# Altium schematic sheet TOP.SchDoc
size A4
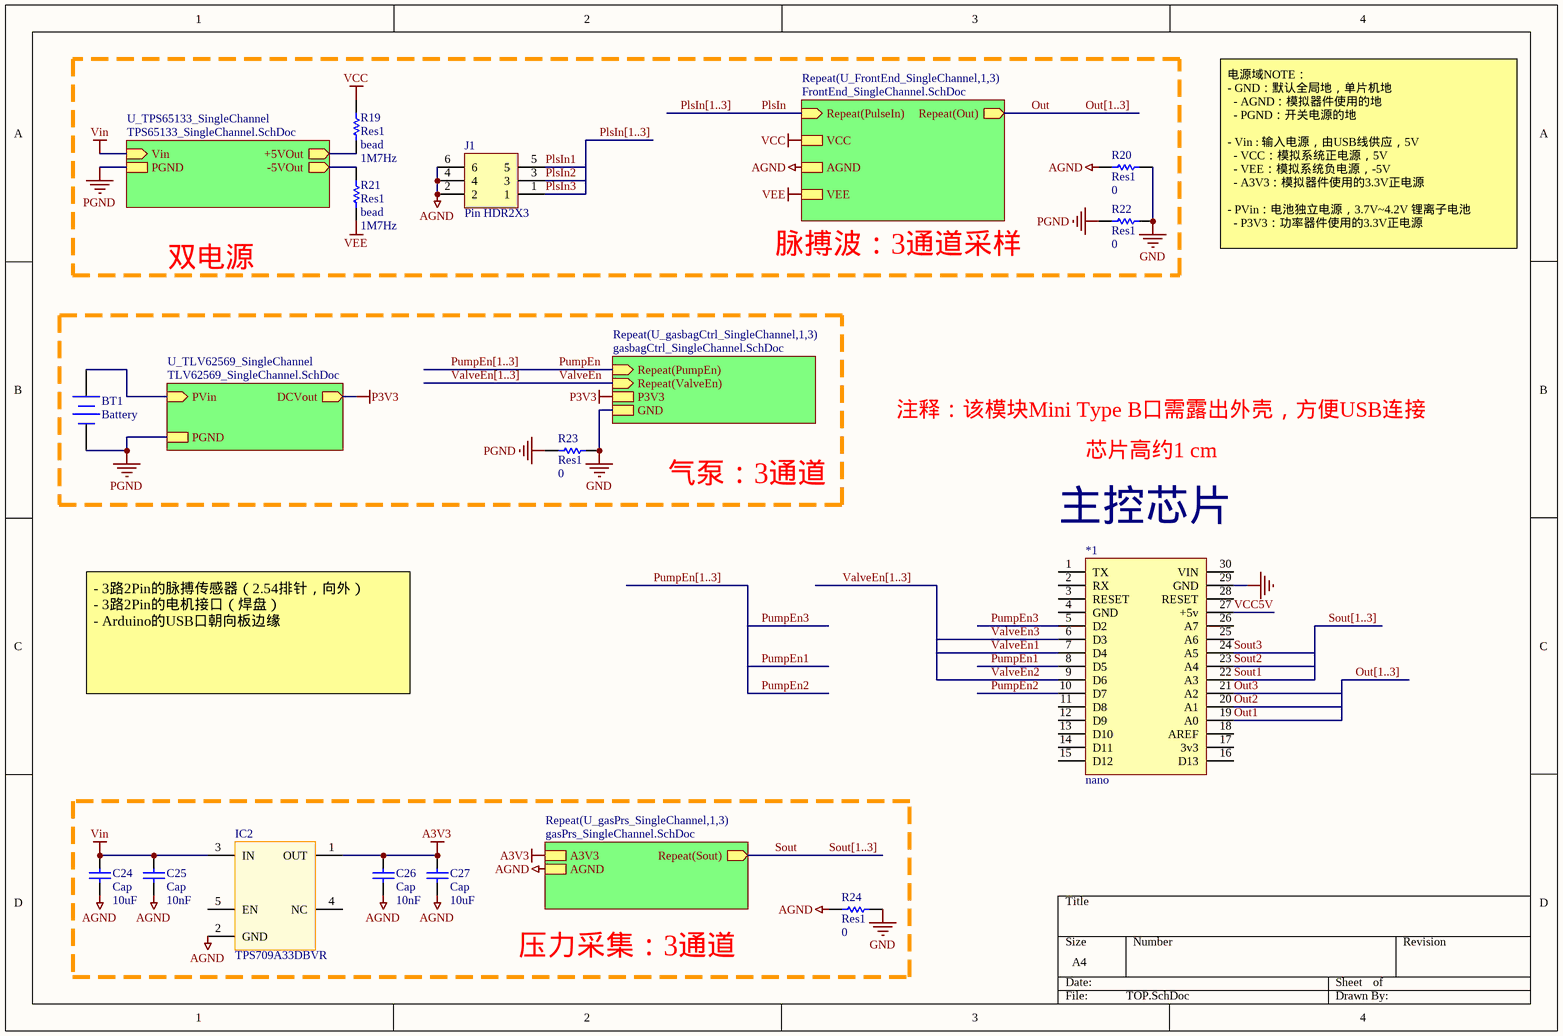
[diagram p0: TOP.SchDoc]

## Parts
*1  nano  [nano]
BT1  Battery  [BAT-2]
C24  Cap  value 10uF  [0603C]
C25  Cap  value 10nF  [0603C]
C26  Cap  value 10nF  [0603C]
C27  Cap  value 10uF  [0603C]
IC2  TPS709A33DBVR  [SOT95P280X145-5N]
J1  Pin HDR2X3  [Pin HDR2X3/2.54mm-S]
R19  Res1  value bead  Frequency: 1M7Hz  [0603R]
R20  Res1  value 0  [0603R]
R21  Res1  value bead  Frequency: 1M7Hz  [0603R]
R22  Res1  value 0  [0603R]
R23  Res1  value 0  [0603R]
R24  Res1  value 0  [0603R]

## Blocks framed on the sheet
气泵：3通道: BT1 R23
压力采集：3通道: C24-C27 IC2 R24

## Sub-sheets
Repeat(U_FrontEnd_SingleChannel,1,3) = FrontEnd_SingleChannel.SchDoc: Repeat(PulseIn) (in), AGND, Repeat(Out) (out), VCC, VEE
Repeat(U_gasbagCtrl_SingleChannel,1,3) = gasbagCtrl_SingleChannel.SchDoc: Repeat(PumpEn) (in), Repeat(ValveEn) (in), P3V3, GND
Repeat(U_gasPrs_SingleChannel,1,3) = gasPrs_SingleChannel.SchDoc: Repeat(Sout) (out), A3V3, AGND
U_TLV62569_SingleChannel = TLV62569_SingleChannel.SchDoc: PVin (in), DCVout (out), PGND
U_TPS65133_SingleChannel = TPS65133_SingleChannel.SchDoc: Vin (in), +5VOut (out), -5VOut (out), PGND

## Nets
A3V3: C26.2 C27.2 IC2.1(OUT) ; sheet Repeat(U_gasPrs_SingleChannel,1,3)/A3V3
AGND: C24.1 C25.1 C26.1 C27.1 IC2.2(GND) J1.2 J1.4 J1.6 R20.1 R24.1 ; sheet Repeat(U_FrontEnd_SingleChannel,1,3)/AGND, sheet Repeat(U_gasPrs_SingleChannel,1,3)/AGND
GND: *1.29(GND) R20.2 R22.2 R23.2 R24.2 ; sheet Repeat(U_gasbagCtrl_SingleChannel,1,3)/GND
P3V3: sheet Repeat(U_gasbagCtrl_SingleChannel,1,3)/P3V3, sheet U_TLV62569_SingleChannel/DCVout
PGND: BT1.2(-) R22.1 R23.1 ; sheet U_TPS65133_SingleChannel/PGND, sheet U_TLV62569_SingleChannel/PGND
VCC: R19.2 ; sheet Repeat(U_FrontEnd_SingleChannel,1,3)/VCC
VEE: R21.1 ; sheet Repeat(U_FrontEnd_SingleChannel,1,3)/VEE
Vin: C24.2 C25.2 IC2.3(IN) ; sheet U_TPS65133_SingleChannel/Vin
Out: sheet Repeat(U_FrontEnd_SingleChannel,1,3)/Repeat(Out)
Out1: *1.19(A0)
Out2: *1.20(A1)
Out3: *1.21(A2)
PlsIn: sheet Repeat(U_FrontEnd_SingleChannel,1,3)/Repeat(PulseIn)
PlsIn1: J1.5
PlsIn2: J1.3
PlsIn3: J1.1
PumpEn: sheet Repeat(U_gasbagCtrl_SingleChannel,1,3)/Repeat(PumpEn)
PumpEn1: *1.8(D5)
PumpEn2: *1.10(D7)
PumpEn3: *1.5(D2)
Sout: sheet Repeat(U_gasPrs_SingleChannel,1,3)/Repeat(Sout)
Sout1: *1.22(A3)
Sout2: *1.23(A4)
Sout3: *1.24(A5)
ValveEn: sheet Repeat(U_gasbagCtrl_SingleChannel,1,3)/Repeat(ValveEn)
ValveEn1: *1.7(D4)
ValveEn2: *1.9(D6)
ValveEn3: *1.6(D3)
VCC5V: *1.27(+5v)
NetBT1_1: BT1.1(+) ; sheet U_TLV62569_SingleChannel/PVin
NetR19_1: R19.1 ; sheet U_TPS65133_SingleChannel/+5VOut
NetR21_2: R21.2 ; sheet U_TPS65133_SingleChannel/-5VOut

Not connected (* = marked no-connect by the designer): *1 1(TX) 2(RX) 3(RESET) 4(GND) 11(D8) 12(D9) 13(D10) 14(D11) 15(D12) 16(D13) 17(3v3) 18(AREF) 25(A6) 26(A7) 28(RESET) 30(VIN); IC2 4(NC) 5(EN)

## Buses and harness runs
bus Out[1..3]
bus PlsIn[1..3]
bus PumpEn[1..3]
bus Sout[1..3]
bus ValveEn[1..3]

## Notes on the sheet
- 电源域NOTE：
  - GND：默认全局地，单片机地
  - AGND：模拟器件使用的地
  - PGND：开关电源的地
  - Vin : 输入电源，由USB线供应，5V
  - VCC：模拟系统正电源，5V
  - VEE：模拟系统负电源，-5V
  - A3V3：模拟器件使用的3.3V正电源
  - PVin：电池独立电源，3.7V~4.2V 锂离子电池
  - P3V3：功率器件使用的3.3V正电源
- 双电源
- 脉搏波：3通道采样
- 注释：该模块Mini Type B口需露出外壳，方便USB连接
- 芯片高约1 cm
- (near *1) 主控芯片
- - 3路2Pin的脉搏传感器（2.54排针，向外）
  - 3路2Pin的电机接口（焊盘）
  - Arduino的USB口朝向板边缘

## Library data of the parts
BT1 = Battery: Multicell Battery; Published: 24-Mar-1999; LatestRevisionDate: 17-Jul-2002; LatestRevisionNote: Re-released for DXP Platform.; PackageReference: BAT-2; Publisher: Altium Limited; PackageDescription: Battery; 2 Leads
C24-C27 = Cap: Capacitor; Published: 8-Jun-2000; LatestRevisionDate: 17-Jul-2002; LatestRevisionNote: Re-released for DXP Platform.; PackageReference: RAD-0.3; Publisher: Altium Limited; PackageDescription: Radial Cap, Thru-Hole; 2 Leads; 0.3 in Pin Spacing
IC2 = TPS709A33DBVR: 3.3V 高CMRR LDO; Manufacturer_Name: Texas Instruments; Datasheet Link: http://www.ti.com/lit/gpn/tps709; Height: 1.45mm; Manufacturer_Part_Number: TPS709A33DBVR; Mouser Part Number: 595-TPS709A33DBVR; Mouser Price/Stock: https://www.mouser.co.uk/ProductDetail/Texas-Instruments/TPS709A33DBVR?qs=8%2FmU9qzJpL8xC3krkiti2Q%3D%3D; Arrow Part Number: TPS709A33DBVR; Arrow Price/Stock: https://www.arrow.com/en/products/tps709a33dbvr/texas-instruments?region=nac
R19-R24 = Res1: Resistor; Published: 8-Jun-2000; LatestRevisionDate: 17-Jul-2002; LatestRevisionNote: Re-released for DXP Platform.; PackageReference: AXIAL-0.3; Publisher: Altium Limited; PackageDescription: Axial Device, Thru-Hole; 2 Leads; 0.3 in Pin Spacing